# EAGLE schematic MF_badge_2021_rev_C (EAGLE 9.6.2)
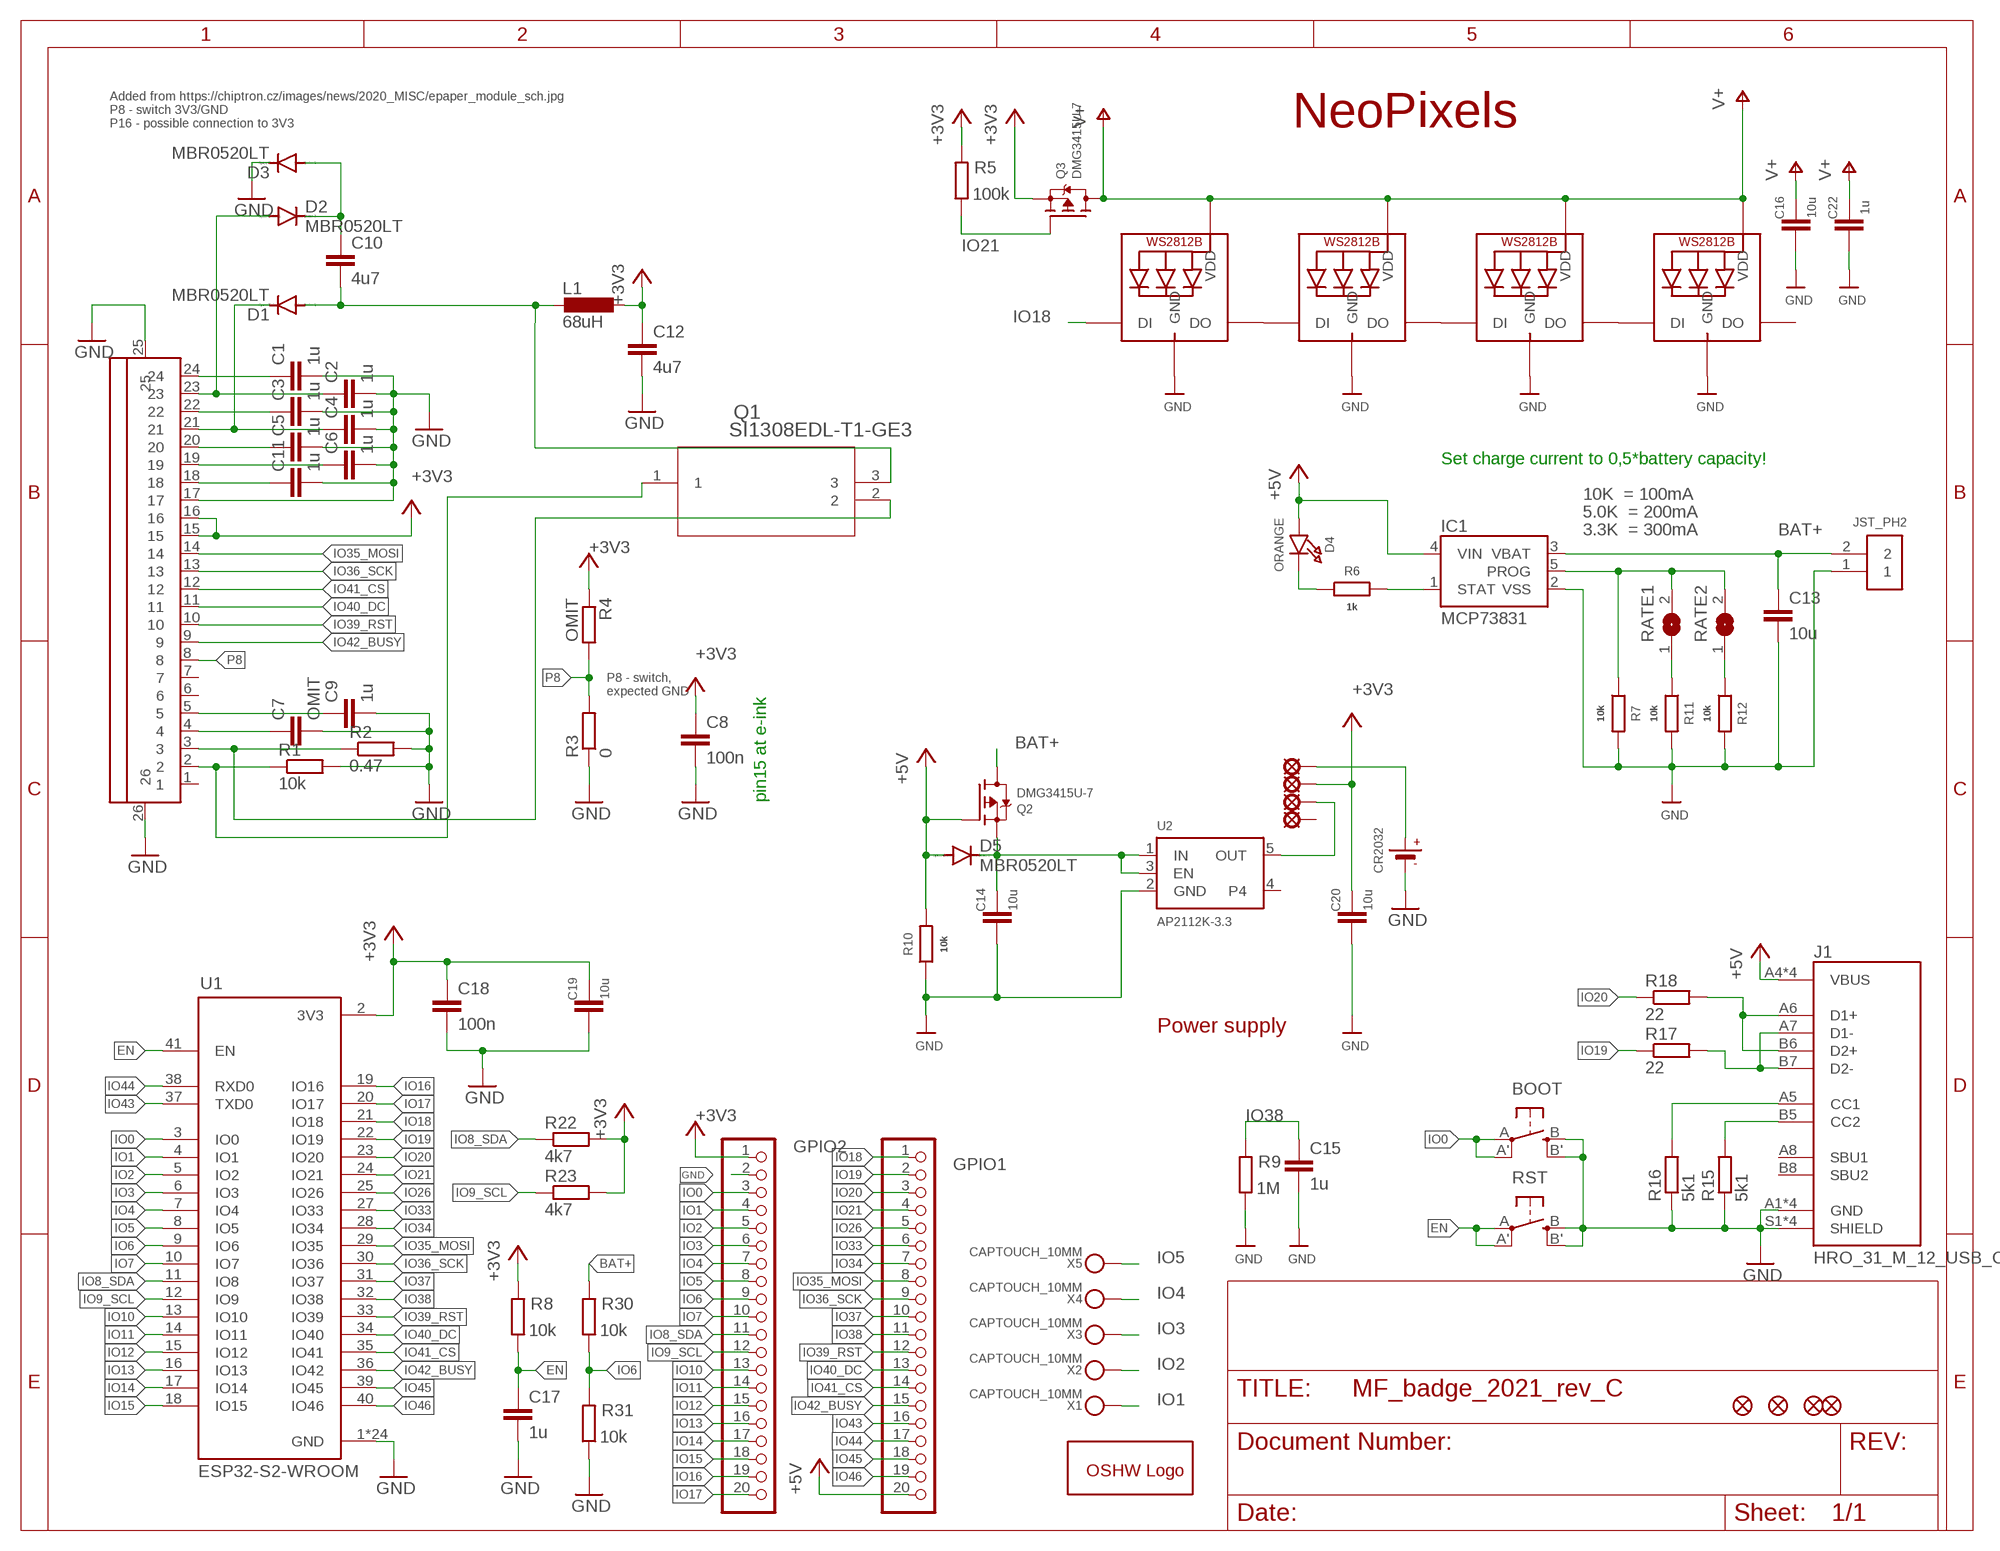
[diagram p0: schematic, sheet 1]

## Parts
BOOT  BUTTON_KMR2_4.6X2.8  [BUTTON_KMR2_4.6X2.8]
C1  1u  C-EUC0805  [C0805]
C2  1u  C-EUC0805  [C0805]
C3  1u  C-EUC0805  [C0805]
C4  1u  C-EUC0805  [C0805]
C5  1u  C-EUC0805  [C0805]
C6  1u  C-EUC0805  [C0805]
C7  OMIT  C-EUC0805  [C0805]
C8  100n  C-EUC0805  [C0805]
C9  1u  C-EUC0805  [C0805]
C10  4u7  C-EUC0805  [C0805]
C11  1u  C-EUC0805  [C0805]
C12  4u7  C-EUC0805  [C0805]
C13  10u  C-EUC0805  [C0805]
C14  10u  C-EUC0805  [C0805]
C15  1u  C-EUC0805  [C0805]
C16  10u  C-EUC0805  [C0805]
C17  1u  C-EUC0805  [C0805]
C18  100n  C-EUC0805  [C0805]
C19  10u  C-EUC0805  [C0805]
C20  10u  C-EUC0805  [C0805]
C22  1u  C-EUC0805  [C0805]
CR2032  BATTERYCR2032_BAT-HLD-001  [CR2032_SMT_BAT-HLD-001]
D1  MBR0520LT  [SOD123]
D2  MBR0520LT  [SOD123]
D3  MBR0520LT  [SOD123]
D4  ORANGE  LED0805_NOOUTLINE  [CHIPLED_0805_NOOUTLINE]
D5  MBR0520LT  [SOD123]
FID1  FIDUCIAL_1MM  [FIDUCIAL_1MM]
FID2  FIDUCIAL_1MM  [FIDUCIAL_1MM]
FID3  FIDUCIAL_1MM  [FIDUCIAL_1MM]
FID4  FIDUCIAL_1MM  [FIDUCIAL_1MM]
GOLD_ORB_SM1  OSHWLOGO_  [OSHW_5MM_LOGO]
GPIO1  PINHD-1X20  [1X20]
GPIO2  PINHD-1X20  [1X20]
IC1  MCP73831  [SOT95P290X120-5]
J1  HRO_31_M_12_USB_C  [HRO_31_M_12_USB_C]
L1  68uH  L-EUL4532P  [L4532P]
LED2  WS2812B5050  [WS2812B]
LED3  WS2812B5050  [WS2812B]
LED4  WS2812B5050  [WS2812B]
LED5  WS2812B5050  [WS2812B]
LSP1  MCS10B  [MCS10B]
LSP2  MCS10B  [MCS10B]
LSP3  MCS10B  [MCS10B]
LSP4  MCS10B  [MCS10B]
Q1  SI1308EDL-T1-GE3  [MOSFET_8EDL-T1-GE3_VIS]
Q2  DMG3415U-7  MOSFET-P  [SOT23-R]
Q3  DMG3415U-7  MOSFET-P  [SOT23-R]
R1  10k  R-EU_R0805  [R0805]
R2  0.47  R-EU_R0805  [R0805]
R3  0  R-EU_R0805  [R0805]
R4  OMIT  R-EU_R0805  [R0805]
R5  100k  R-EU_R0805  [R0805]
R6  1k  R-EU_R0805  [R0805]
R7  10k  R-EU_R0805  [R0805]
R8  10k  R-EU_R0805  [R0805]
R9  1M  R-EU_R0805  [R0805]
R10  10k  R-EU_R0805  [R0805]
R11  10k  R-EU_R0805  [R0805]
R12  10k  R-EU_R0805  [R0805]
R15  5k1  R-EU_R0805  [R0805]
R16  5k1  R-EU_R0805  [R0805]
R17  22  R-EU_R0805  [R0805]
R18  22  R-EU_R0805  [R0805]
R22  4k7  R-EU_R0805  [R0805]
R23  4k7  R-EU_R0805  [R0805]
R30  10k  R-EU_R0805  [R0805]
R31  10k  R-EU_R0805  [R0805]
RATE1  SOLDERJUMPER  [SOLDERJUMPER_ARROW_NOPASTE]
RATE2  SOLDERJUMPER  [SOLDERJUMPER_ARROW_NOPASTE]
RST  BUTTON_KMR2_4.6X2.8  [BUTTON_KMR2_4.6X2.8]
U1  ESP32-S2-WROOM  [XCVR_ESP32-S2-WROOM]
U2  AP2112K-3.3  VREG_SOT23-5  [SOT23-5]
U$1  2.13_EINK  [2.13_EINK]
U$8  JST_PH2  [JSTPH2]
X1  CAPTOUCH_10MM  CAPTOUCH_MONOPAD_6X9  [CAPTOUCH_6X9MM]
X2  CAPTOUCH_10MM  CAPTOUCH_MONOPAD_6X9  [CAPTOUCH_6X9MM]
X3  CAPTOUCH_10MM  CAPTOUCH_MONOPAD_6X9  [CAPTOUCH_6X9MM]
X4  CAPTOUCH_10MM  CAPTOUCH_MONOPAD_6X9  [CAPTOUCH_6X9MM]
X5  CAPTOUCH_10MM  CAPTOUCH_MONOPAD_6X9  [CAPTOUCH_6X9MM]

## Nets
+3V3 [power]: C8.1 C12.1 C18.1 C19.1 C20.1 GPIO2.1 L1.1 LSP2.MP Q3.2(S) R4.1 R5.2 R8.2 R22.2 R23.2 U1.2(3V3) U$1.15 U$1.16
+5V: D4.A D5.A GPIO1.20 IC1.4(VIN) J1.A4(VBUS) J1.A9(VBUS) J1.B4(VBUS) J1.B9(VBUS) Q2.1(G) R10.2
BAT+: C13.1 IC1.3(VBAT) Q2.3(D) R30.2 U$8.2
D+_CON: J1.A6(D1+) J1.B6(D2+) R18.2
D-_CON: J1.A7(D1-) J1.B7(D2-) R17.2
EN: C17.1 R8.1 RST.A'(P1) RST.A(P) U1.41(EN)
GND: BOOT.B'(S1) BOOT.B(S) C1.2 C2.2 C3.2 C4.2 C5.2 C6.2 C7.2 C8.2 C9.2 C11.2 C12.2 C13.2 C14.2 C15.2 C16.2 C17.2 C18.2 C19.2 C20.2 C22.2 CR2032.- D3.C GPIO2.2 IC1.2(VSS) J1.A1(GND) J1.A12(GND) J1.B1(GND) J1.B12(GND) J1.S1(SHIELD) J1.S2(SHIELD) J1.S3(SHIELD) J1.S4(SHIELD) LED2.3-GND(GND) LED3.3-GND(GND) LED4.3-GND(GND) LED5.3-GND(GND) R1.2 R2.2 R3.1 R7.2 R9.1 R10.1 R11.2 R12.2 R15.1 R16.1 R31.1 RST.B'(S1) RST.B(S) U1.1(GND) U1.26(GND) U1.42(GND) U1.43.1(GND) U1.43.2(GND) U1.43.3(GND) U1.43.4(GND) U1.43.5(GND) U1.43.6(GND) U1.43.7(GND) U1.43.8(GND) U1.43.9(GND) U1.43.10(GND) U1.43.11(GND) U1.43.12(GND) U1.43.13(GND) U1.43.14(GND) U1.43.15(GND) U1.43.16(GND) U1.43.17(GND) U1.43.18(GND) U1.43.19(GND) U1.43.20(GND) U1.43.21(GND) U2.2(GND) U$1.17 U$1.25 U$1.26 U$8.1
IO0: BOOT.A'(P1) BOOT.A(P) GPIO2.3 U1.3(IO0)
IO1: GPIO2.4 U1.4(IO1) X1.P$1
IO2: GPIO2.5 U1.5(IO2) X2.P$1
IO3: GPIO2.6 U1.6(IO3) X3.P$1
IO4: GPIO2.7 U1.7(IO4) X4.P$1
IO5: GPIO2.8 U1.8(IO5) X5.P$1
IO6: GPIO2.9 R30.1 R31.2 U1.9(IO6)
IO7: GPIO2.10 U1.10(IO7)
IO8_SDA: GPIO2.11 R22.1 U1.11(IO8)
IO9_SCL: GPIO2.12 R23.1 U1.12(IO9)
IO10: GPIO2.13 U1.13(IO10)
IO11: GPIO2.14 U1.14(IO11)
IO12: GPIO2.15 U1.15(IO12)
IO13: GPIO2.16 U1.16(IO13)
IO14: GPIO2.17 U1.17(IO14)
IO15: GPIO2.18 U1.18(IO15)
IO16: GPIO2.19 U1.19(IO16)
IO17: GPIO2.20 U1.20(IO17)
IO18: GPIO1.1 LED2.4-DIN(DI) U1.21(IO18)
IO19: GPIO1.2 R17.1 U1.22(IO19)
IO20: GPIO1.3 R18.1 U1.23(IO20)
IO21: GPIO1.4 Q3.1(G) R5.1 U1.24(IO21)
IO26: GPIO1.5 U1.25(IO26)
IO33: GPIO1.6 U1.27(IO33)
IO34: GPIO1.7 U1.28(IO34)
IO35_MOSI: GPIO1.8 U1.29(IO35) U$1.14
IO36_SCK: GPIO1.9 U1.30(IO36) U$1.13
IO37: GPIO1.10 U1.31(IO37)
IO38: C15.1 GPIO1.11 R9.2 U1.32(IO38)
IO39_RST: GPIO1.12 U1.33(IO39) U$1.10
IO40_DC: GPIO1.13 U1.34(IO40) U$1.11
IO41_CS: GPIO1.14 U1.35(IO41) U$1.12
IO42_BUSY: GPIO1.15 U1.36(IO42) U$1.9
IO43: GPIO1.16 U1.37(TXD0)
IO44: GPIO1.17 U1.38(RXD0)
IO45: GPIO1.18 U1.39(IO45)
IO46: GPIO1.19 U1.40(IO46)
N$1: C1.1 U$1.24
N$2: C2.1 D2.A U$1.23
N$3: C3.1 U$1.22
N$4: C4.1 D1.C U$1.21
N$5: C5.1 U$1.20
N$6: C6.1 U$1.19
N$7: C11.1 U$1.18
N$8: IC1.1(STAT) R6.2
N$9: C14.1 D5.C Q2.2(S) U2.1(IN) U2.3(EN)
N$10: Q1.2 R2.1 U$1.3
N$11: C9.1 U$1.5
N$12: C7.1 U$1.4
N$13: Q1.1 R1.1 U$1.2
N$15: D4.C R6.1
N$16: C10.1 D2.C D3.A
N$17: LED2.2-DOUT(DO) LED3.4-DIN(DI)
N$19: C10.2 D1.A L1.2 Q1.3
N$20: R11.1 RATE1.1
N$21: R12.1 RATE2.1
N$22: LED4.2-DOUT(DO) LED5.4-DIN(DI)
N$23: J1.B5(CC2) R15.2
N$24: J1.A5(CC1) R16.2
N$25: LED3.2-DOUT(DO) LED4.4-DIN(DI)
N$26: CR2032.+$1(+) CR2032.+$2(+) LSP1.MP
OUT [power]: LSP3.MP U2.5(OUT)
P8: R3.2 R4.2 U$1.8
PROG: IC1.5(PROG) R7.1 RATE1.2 RATE2.2
V+: C16.1 C22.1 LED2.1-VDD(VDD) LED3.1-VDD(VDD) LED4.1-VDD(VDD) LED5.1-VDD(VDD) Q3.3(D)
Unconnected: J1.A8(SBU1) J1.B8(SBU2) LED5.2-DOUT(DO) LSP4.MP U2.4 U$1.1 U$1.6 U$1.7

## Notes on the sheet
- NeoPixels
- Added from https://chiptron.cz/images/news/2020_MISC/epaper_module_sch.jpg
  P8 - switch 3V3/GND
  P16 - possible connection to 3V3
- Set charge current to 0,5*battery capacity!
- 10K  = 100mA
- 5.0K  = 200mA
- 3.3K  = 300mA
- P8 - switch,
  expected GND
- pin15 at e-ink
- Power supply

## Library data of the parts
BOOT RST = dronecz:BUTTON_KMR2_4.6X2.8: SMT Tact Switches 6x6mm - Digikey: P12940SCT-ND KMR2 (4.6x2.8mm) - Digikey: 401-1426-1-ND EVQ-PQHB55 - Light Touch, 160GF (4.5x4.5mm) - Digikey: P8090SCT-ND Farnell (KMR221NG) - 2845727
C1-C20 C22 = rcl:C-EU: CAPACITOR, European symbol; SPICEPREFIX: C
CR2032 = microbuilder:BATTERY: CR1220 SMT - Digikey: 3001K-ND CD2032 BAT-HLD-001 - Digikey: BAT-HLD-001-ND
D1-D3 D5 = diode:MBR0520LT: SCHOTTKY BARRIER RECTIFIER Source: http://onsemi.com .. MBR0520LT1-D.pdf
D4 = microbuilder:LED: LED 0603 - 0603 Surface Mount Package 2mA: Green LED - Low Power (3.9mcd, 2ma, 1.7Vf) - Digikey: 475-2709-2-ND Orange LED - Low Power (9.8mcd, 2ma, 1.8Vf) - Digikey: 475-1194-2-ND Red LED - Low Power (5mcd, 2ma, 1.8Vf) - Digikey: 475-1195-2-ND Yellow LED - Low Power (7mcd, 2ma, 1.8Vf) - Digikey: 475-1196-2-ND 5mA: Blue LED - Low Power (17mcd, 5ma, 2.9Vf) - Digikey: LNJ937W8CRACT-ND 0805 - 0805 Surface Mount Package 2mA: Red LED (8.8mcd, 2mA, 1.8Vf, Clear) - Low Power [Digikey: 475-2510-1-ND] Green LED (5mcd, 2mA, 1.8Vf, Clear) - Low Power [Digikey: 475-2730-1-ND] Yellow LED (11.3mcd, 2mA, 1.8Vf, Clear) - Low Power [Digikey: 475-2555-1-ND] 20mA: Red LED (104mcd, 20mA, Diffused) - LS R976 [Digikey: 475-1278-6-ND] Red LED (12mcd, 20mA, 2.0Vf, Clear) - APT2012EC [Digikey: 754-1128-1-ND] Green LED (15mcd, 20mA, 2.2Vf, Clear) - APT2012GC [Digikey: 754-1131-1-ND] Orange LED (160mcd, 20mA, 2.1Vf, Clear) - APT2012SECK [Digikey: 754-1130-1-ND] 1206 - 1206 Surface Mount Package Green LED (26mcd, 20mA, Diffused) - LG N971 [Digikey: 475-1407-6-ND] Red LED (15mcd, 20mA, Diffused) - LH N974 [Digikey: 475-1416-6-ND] Cree - Cree High-Power Surface Mount LEDs XPEBWT-L1-0000-00D50 - White 111lm 350mA 2.9Vf 6200K 110° XTEAWT-00-0000-00000LEE3 - White 114lm 350mA 2.85Vf 5000K 115° Everlight - Everlight 45-21 Series Surface Mount LEDs 45-21/QK2C-B2832AC2CB2/2T - Warm White 2000mcd 20mA 3.25Vf 3050K 120° 45-21/LK2C-B38452C4CB2/2T - Nuetral White 2000mcd 20mA 3.25Vf 4150K 120° 45-21/LK2C-B50634C6CB2/2T - Cold White 2200mcd 20mA 3.25Vf 5650K 120° PLCC2 Reverse Mount LS T77K-J1L2-1-0-2-R18-Z - Red 11.25mcd 2mA 1.8Vf 630nm 120° LO T77K-L1M2-24-Z - Orange 19.6mcd 2mA 1.8Vf 606nm 120° LY T77K-K2M1-26-Z - Yellow 15.7mcd 2mA 1.8Vf 587nm 120°
FID1-FID4 = microbuilder:FIDUCIAL: Fiducial Alignment Points Various fiducial points for machine vision alignment.; BOM: EXCLUDE
GOLD_ORB_SM1 = oshw:OSHWLOGO: The OSHW logo for PCB layout
GPIO1 GPIO2 = pinhead:PINHD-1X20: PIN HEADER
IC1 = Bastlir:MCP73831
J1 = Bastlir:HRO_31_M_12_USB_C: USB Shielded I/O Receptacle; Type C; Right Angle; Surface Mount; Gold over Nickel
L1 = rcl:L-EU: INDUCTOR, European symbol; SPICEPREFIX: L
LED2-LED5 = microbuilder:WS2812B
LSP1-LSP4 = solpad:MCS10B: SOLDER PAD MC S1, distributor Buerklin, 15F505
Q1 = SI1308EDL-T1-GE3:SI1308EDL-T1-GE3; COPYRIGHT: Copyright (C) 2022 Ultra Librarian. All rights reserved.; DIGI-KEY_PART_NUMBER_1: SI1308EDL-T1-GE3TR-ND; DIGI-KEY_PART_NUMBER_2: SI1308EDL-T1-GE3CT-ND; DIGI-KEY_PART_NUMBER_3: SI1308EDL-T1-GE3DKR-ND; MANUFACTURER_PART_NUMBER: SI1308EDL-T1-GE3; MFR_NAME: Vishay
Q2 Q3 = microbuilder:MOSFET-P: P-Channel Mosfet LEGEND VDS: Voltage Drain-Source ID: Drain Current RDS(ON): Drain-Source On-State Resistance VGS(TH): Gate-Source Threshold Voltage CISS: Drain-Source Input Capacitance SOT-23 Name VDS ID RDS(ON) VGS(TH) CISS Order Number IRLML5103 30V 760mA 600 mOhm -- 75pF @ 25V Digikey: IRLML5103PBFCT-ND IRLML6401 12V 4.3A 50 mOhm 950mV @ 250µA 830pF @ 10V Digikey: IRLML6401PBFTR-ND NTR0202PL 20V 400mA 800 mOhm 2.3V @ 250uA 70pF @ 5V Digikey: NTR0202PLT1GOSTR-ND NTR4101PT1G 20V 1.8A 85 mOhm 1.2V @ 250uA 675pF @ 10V Digikey: NTR4101PT1GOSCT-ND DMP2004K 20V 600mA 900 mOhm 1V @ 250uA 175pF @ 16V Digikey: DMP2004KDICT-ND PMV65XP 20V 3.9A 76 mOhm 950mV @ 1mA 725pF @ 20V Digikey: 568-2358-2-ND TO-252 Name VDS ID RDS(ON) VGS(TH) CISS Order Number AOD417 30V 25A 34 mOhm 3V @ 250µA 920pF @ 15V Digikey: 785-1106-2-ND PowerPak Name VDS ID RDS(ON) VGS(TH) CISS Order Number AON7401 30V 12A 14 mOhm 3V @ 250µA 2600pF @ 15V Digikey: 785-1302-1-ND
R1-R12 R15-R18 R22 R23 R30 R31 = rcl:R-EU_: RESISTOR, European symbol; SPICEPREFIX: R
RATE1 RATE2 = microbuilder:SOLDERJUMPER: SMD Solder JUMPER Solder the two pads together to create a connection, or remove the solder to break it. REFLOW - Use this footprint for solder paste and reflow ovens. WAVE - Use this footprint for hand-soldering (larger pads). CLOSED - Has a trace between the two pads to ensure it is closed by default. The trace needs to be cut to disable the jumper, and can be closed again by creating a solder bridge between the two pads.; BOM: EXCLUDE
U1 = Bastlir:ESP32-S2-WROOM: WiFi 802.11b/g/n Transceiver Module 2.4GHz PCB Trace Surface Mount Check prices <https://pricing.snapeda.com/search/part/ESP32-S2-WROOM/?ref=eda>; AVAILABILITY: Bad; DESCRIPTION: WiFi 802.11b/g/n Transceiver Module 2.4GHz PCB Trace Surface Mount; MF: Espressif Systems; MP: ESP32-S2-WROOM; PACKAGE: VFQFN-56 Espressif Systems; PRICE: None
U2 = microbuilder:VREG_SOT23-5: SOT23-5 Fixed Voltage Regulators Part Current Out V Out V In V Dropout θJA (°C/W) TJ (°C) Digikey Part No. ADP121 150mA 3.3V 3.4-5.5V 0.09V @ 150mA -- -- ADP121-AUJZ33R7CT-ND ADP121 150mA 3.0V 3.1-5.5V 0.09V @ 150mA -- -- ADP121-AUJZ30R7CT-ND ADP122 300mA 3.3V 3.4-5.5V 0.085V @ 300mA -- -- ADP122AUJZ-3.3-R7CT-ND ADP1712 300mA 3.3V 3.5-5.5V 0.17V @ 300mA -- -- ADP1712AUJZ-3.3-R7TR-ND AP7311 (Low Cost) 150mA 3.3V 3.5-6V 0.15V @ 150mA -- -- AP7311-33WG-7DICT-ND LD39015M18R 150mA 1.8V 1.9V-5.5V 0.08V @ 100mA -- -- 497-6977-1-ND LP2985A-33DBVR 150mA 3.3V 3.3-16V 0.28V @ 150mA 206 150 296-18479-1-ND MCP1824T-3302E/OT 300mA 3.3V 3.5V-6V 0.2V @ 300mA -- -- MCP1824T-3302E/OTCT-ND MIC5205-2.5YM5 TR 150mA 2.5V 2.7-16V 0.165V @ 150mA -- -- 576-1257-2-ND MIC5205-3.0YM5 TR 150mA 3.0V 3.2V-16V 0.165V @ 150mA -- -- 576-1258-2-ND MIC5205-3.3YM5 TR 150mA 3.3V 3.5V-16V 0.165V @ 150mA -- -- 576-1259-2-ND TPS780330220 150mA 3.3V+2.2V 3.6-5.5V 250mV Max -- -- 296-23332-1-ND TDA3663/N1,135 100mA 3.3V 3.5-45V 0.18V @ 50mA -- -- 568-5343-1-ND Max operating temp can be calculated using θJA, TJ (max junction temperature), and power in watts. Set the "Maximum Ambient Temperature" until it reaches TJ ("Max Junction Temperature"), which is the absolute limit for safe use of the regulator: Heat Sink Temperature Calculator <http://www.daycounter.com/Calculators/Heat-Sink-Temperature-Calculator.phtml> For example, With 12V source into a 3.3V LP2985 and a 30mA load, we are dissipating (12V-3.3V) * 0.03A = 0.261W. With a θJA of 206 °C/W, a TJ of 150°C, and 261mW we can safely use the chip without a heat sink up to 75°C (=147.1°C Junction Temperature).
U$1 = dronecz:2.13_EINK
U$8 = Bastlir:JST_PH2
X1-X5 = adafruit_electromech:CAPTOUCH_MONOPAD

## Net classes
1 power: width 0.508 mm
2 lowpower: width 0.305 mm, drill 0.483 mm